# Altium project Beacon.PrjPcb
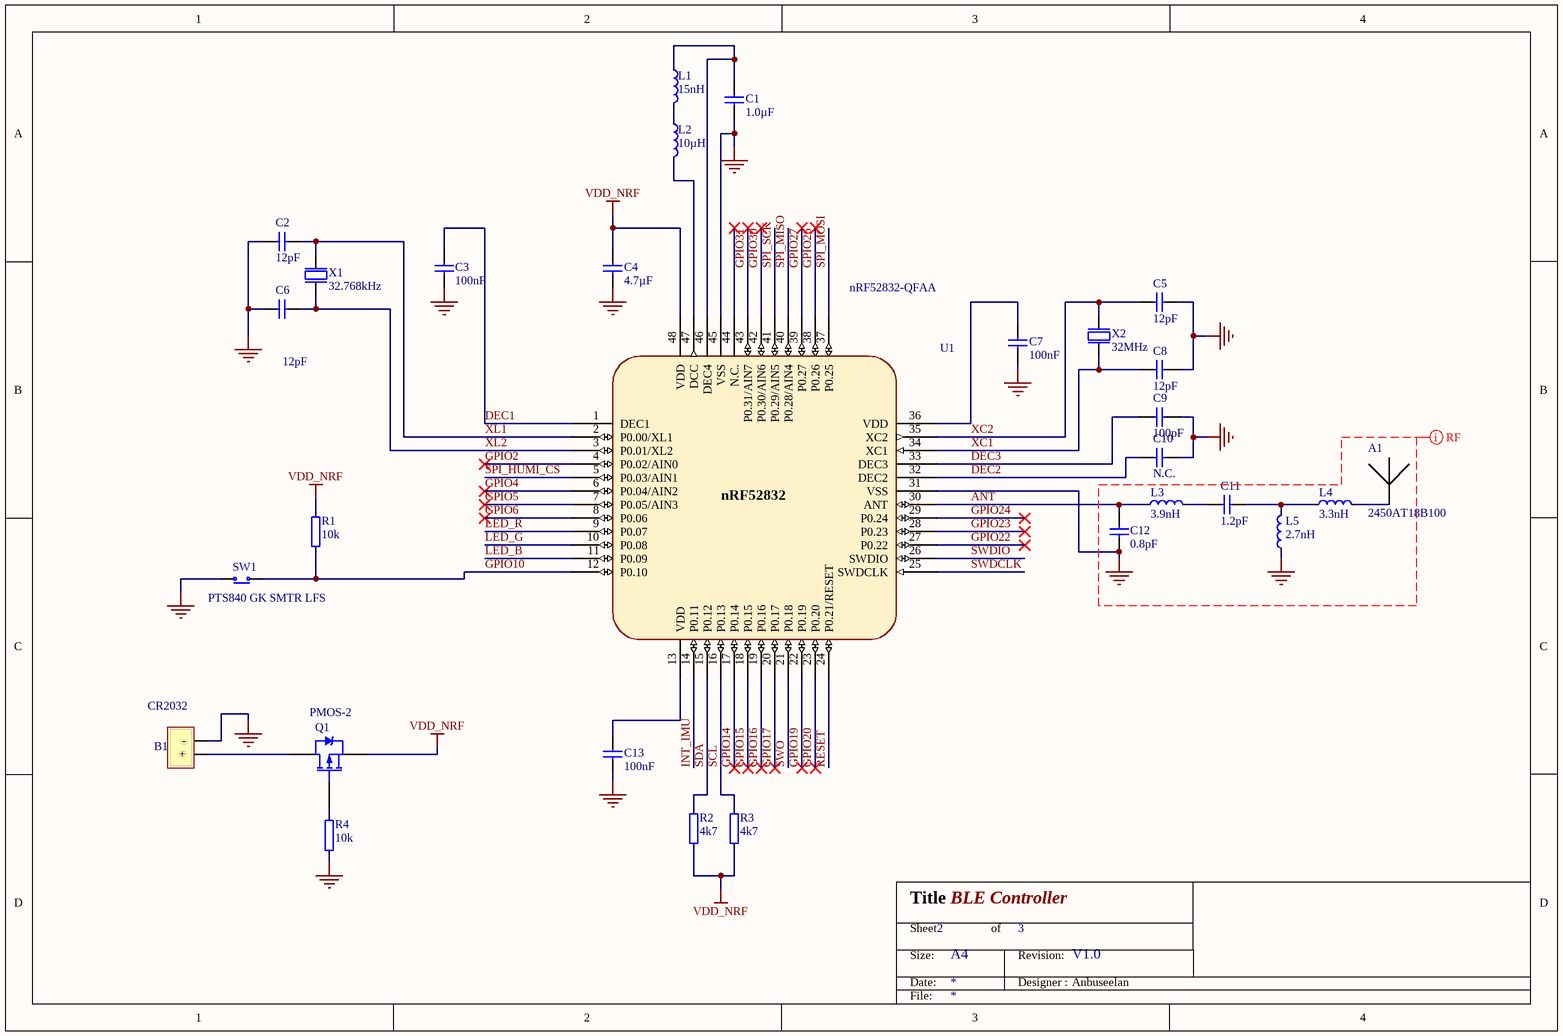
[diagram p0: 02NRF52.SchDoc]
3 sheets, 43 parts. Net scope: global (net labels, ports and power ports of the same name join across sheets).
Board file: Beacon.PcbDoc
Sheets:
  01Main.SchDoc
  02NRF52.SchDoc
  03Sensors.SchDoc

## Sheet 01Main.SchDoc: MainSheet
size A4; Organization: Altium Limited; Revision: V1.0; SheetNumber: 1; SheetTotal: 3

### Notes on the sheet
- Title
- Size:
- Date:
- Sheet
- A4
- of
- Revision:
- Designer :
- Anbuseelan
- File:

## Sheet 02NRF52.SchDoc: BLE Controller
size A4; Organization: Altium Limited; Address1: L3, 12a Rodborough Rd; Address2: Frenchs Forest; Address3: NSW; Address4: Australia 2086; Revision: V1.0; SheetNumber: 2; SheetTotal: 3

### Parts
A1  2450AT18B100  [2450AT18B100]
B1  CR2032  [CR2032-SMD_CR2032(Primary)]
C1  1.0µF  [CAPC1608X06L]
C2  12pF  [CAPC1005X04L]
C3  100nF  [CAPC1005X04L]
C4  4.7µF  [CAPC1608X06L]
C5  12pF  [CAPC1005X04L]
C6  12pF  [CAPC1005X04L]
C7  100nF  [CAPC1005X04L]
C8  12pF  [CAPC1005X04L]
C9  100pF  [CAPC1005X04L]
C10  N.C.  [CAPC1005X04L]
C11  1.2pF  [CAPC1005X04L]
C12  0.8pF  [CAPC1005X04L]
C13  100nF  [CAPC1005X04L]
L1  15nH  [INDC1005X04L]
L2  10µH  [INDC1608X06L]
L3  3.9nH  [INDC1005X04L]
L4  3.3nH  [INDC1005X04L]
L5  2.7nH  [INDC1005X04L]
Q1  PMOS-2  [SOT23_N]
R1  10k  [RESC1005X04L]
R2  4k7  [RESC1005X04L]
R3  4k7  [RESC1005X04L]
R4  10k  [RESC1005X04L]
SW1  PTS840 GK SMTR LFS  [EVQP7A/J/B/K]
U1  nRF52832-QFAA  [QFN40P600X600X90-48N]
X1  32.768kHz  [XTAL_3215]
X2  32MHz  [BT-XTAL_2016]

### Nets
GND: B1.NEG(-) C1.1 C2.2 C3.2 C4.2 C5.2 C6.2 C7.2 C8.2 C9.2 C10.1 C12.1 C13.2 L5.1 R4.1 SW1.1(N.O) U1.31(VSS) U1.45(VSS) U1.49(GND) X2.2(GND) X2.4(GND)
VDD_NRF: C4.1 Q1.3(S) R1.2 R2.1 R3.1 U1.48(VDD)
ANT: C12.2 L3.1 U1.30(ANT)
DEC1: C3.1 U1.1(DEC1)
DEC2: C10.2 U1.32(DEC2)
DEC3: C9.1 U1.33(DEC3)
GPIO2: U1.4(P0.02/AIN0)
GPIO4: U1.6(P0.04/AIN2)
GPIO5: U1.7(P0.05/AIN3)
GPIO6: U1.8(P0.06)
GPIO10: R1.1 SW1.2(COM) U1.12(P0.10)
GPIO14: U1.17(P0.14)
GPIO15: U1.18(P0.15)
GPIO16: U1.19(P0.16)
GPIO17: U1.20(P0.17)
GPIO19: U1.22(P0.19)
GPIO20: U1.23(P0.20)
GPIO22: U1.27(P0.22)
GPIO23: U1.28(P0.23)
GPIO24: U1.29(P0.24)
GPIO26: U1.38(P0.26)
GPIO27: U1.39(P0.27)
GPIO30: U1.42(P0.30/AIN6)
GPIO31: U1.43(P0.31/AIN7)
INT_IMU: U1.14(P0.11)
LED_B: U1.11(P0.09)
LED_G: U1.10(P0.08)
LED_R: U1.9(P0.07)
RESET: U1.24(P0.21/RESET)
SCL: R3.2 U1.16(P0.13)
SDA: R2.2 U1.15(P0.12)
SPI_HUMI_CS: U1.5(P0.03/AIN1)
SPI_MISO: U1.40(P0.28/AIN4)
SPI_MOSI: U1.37(P0.25)
SPI_SCK: U1.41(P0.29/AIN5)
SWDCLK: U1.25(SWDCLK)
SWDIO: U1.26(SWDIO)
SWO: U1.21(P0.18)
XC1: C8.1 U1.34(XC1) X2.1(inp)
XC2: C5.1 U1.35(XC2) X2.3(out)
XL1: C2.1 U1.2(P0.00/XL1) X1.1(inp)
XL2: C6.1 U1.3(P0.01/XL2) X1.2(out)
NetA1_1: A1.1 L4.2
NetB1_POS: B1.POS(+) Q1.2(D)
NetC1_2: C1.2 L1.1 U1.46(DEC4)
NetC7_1: C7.1 U1.36(VDD)
NetC11_1: C11.1 L3.2
NetC11_2: C11.2 L4.1 L5.2
NetC13_1: C13.1 U1.13(VDD)
NetL1_2: L1.2 L2.1
NetL2_2: L2.2 U1.47(DCC)
NetQ1_1: Q1.1(G) R4.2

Not connected (* = marked no-connect by the designer): U1 44(N.C.)*

### Layout directives
net class RF: GND

### Notes on the sheet
- Title
- Size:
- Date:
- Sheet
- A4
- of
- Revision:
- Designer :
- Anbuseelan
- File:
- (in symbol nRF52832_QFAA) nRF52832

### Library data of the parts
A1 = Antenna: 2.45 GHz chip antenna; Part Number: Johanson 2450AT18B100; Manufacturer: Johanson Technology; Artikkelnr Noca: N.A.; Manufacturer Part Number: 2450AT18B100; Datasheet: http://www.johansontechnology.com/datasheets/antennas/2450AT18B100.pdf; Footprint Doc: 2450AT18B100; LatestRevisionDate: 2013-09-13; Pin Count: 2; Publisher: Nordic Semiconductor; Published: 2013-09-13; Value: 2450AT18B100; Note: *; Supplier: Digi-Key; Supplier part number: 712-1006-1-ND; 2nd source Supplier: *; 2nd source part number: *; Artikkelnr Simpro: N.A.
B1 = CR2032: Energizer CR2032 Lithium Button Cell Battery; MF: Panasonic -; MP: CR2032; Availability: Unavailable; SnapEDA_Link: https://www.snapeda.com/parts/CR2032/Panasonic%20-%20BSG/view-part/?ref=snap; Package: FDK; Price: 2.67 USD; Value: *
C1 = CAP: Capacitor, X7R, ±10%; Part Number: C0603-1µ0; Note: 16V; Artikkelnr Noca: 20039335; Artikkelnr Simpro: N.A.; Manufacturer: *; Manufacturer Part Number: *; Datasheet: *; LatestRevisionDate: 2013-06-05; Pin Count: 2; Publisher: Nordic Semiconductor; Published: 2009-05-08; Value: 1.0µF; Supplier: *; Supplier part number: *; 2nd source Supplier: *; 2nd source part number: *; Footprint Doc: 0603
C2 C5 C6 C8 = CAP: Capacitor, NP0, ±2%; Part Number: C0402-12p; Note: 50V; Artikkelnr Noca: 20029159; Artikkelnr Simpro: N.A.; Manufacturer: *; Manufacturer Part Number: *; Datasheet: *; LatestRevisionDate: 2011-05-11; Pin Count: 2; Publisher: Nordic Semiconductor; Published: 2009-05-08; Value: 12pF; Supplier: *; Supplier part number: *; 2nd source Supplier: *; 2nd source part number: *; Footprint Doc: 0402
C3 C7 C13 = CAP: Capacitor, X7R, ±10%; Part Number: C0402-100n; Note: 16V; Artikkelnr Noca: 20039200; Artikkelnr Simpro: N.A.; Manufacturer: *; Manufacturer Part Number: *; Datasheet: *; LatestRevisionDate: 2009-11-23; Pin Count: 2; Publisher: Nordic Semiconductor; Published: 2009-05-08; Value: 100nF; Supplier: *; Supplier part number: *; 2nd source Supplier: *; 2nd source part number: *; Footprint Doc: 0402
C4 = CAP: Capacitor, X5R, ±10%; Part Number: C0603-4µ7; Note: 6.3V; Artikkelnr Noca: 20069060; Artikkelnr Simpro: N.A.; Manufacturer: *; Manufacturer Part Number: *; Datasheet: *; LatestRevisionDate: 2009-11-23; Pin Count: 2; Publisher: Nordic Semiconductor; Published: 2009-05-08; Value: 4.7µF; Supplier: *; Supplier part number: *; 2nd source Supplier: *; 2nd source part number: *; Footprint Doc: 0603
C9 = CAP: Capacitor, NP0, ±5%; Part Number: C0402-100p; Note: 50V; Artikkelnr Noca: 20029135; Artikkelnr Simpro: N.A.; Manufacturer: *; Manufacturer Part Number: *; Datasheet: *; LatestRevisionDate: 2009-05-08; Pin Count: 2; Publisher: Nordic Semiconductor; Published: 2009-05-08; Value: 100pF; Supplier: *; Supplier part number: *; 2nd source Supplier: *; 2nd source part number: *; Footprint Doc: 0402
C10 = CAP: Not mounted; Part Number: C0402-N.C.; Note: Chip Cap; Artikkelnr Noca: N.A.; Assembly: Not mounted; Manufacturer: *; Manufacturer Part Number: *; Datasheet: *; LatestRevisionDate: 2009-05-08; Pin Count: 2; Publisher: Nordic Semiconductor; Published: 2009-05-08; Value: N.C.; Supplier: *; Supplier part number: *; 2nd source Supplier: *; 2nd source part number: *; Footprint Doc: 0402; Artikkelnr Simpro: N.A.
C11 = CAP: Capacitor, NP0, ±0.1pF; Part Number: C0402-1.2p; Note: 50V; Artikkelnr Noca: 20029157; Artikkelnr Simpro: N.A.; Manufacturer: *; Manufacturer Part Number: *; Datasheet: *; Footprint Doc: 0402; LatestRevisionDate: 2011-05-11; Pin Count: 2; Publisher: Nordic Semiconductor; Published: 2009-05-08; Value: 1.2pF; Supplier: *; Supplier part number: *; 2nd source Supplier: *; 2nd source part number: *
C12 = CAP: Capacitor, NP0, ±5%; Part Number: C0402-0.8p; Note: 50V; Artikkelnr Noca: 20029147; Artikkelnr Simpro: N.A.; Manufacturer: *; Manufacturer Part Number: *; Datasheet: *; LatestRevisionDate: 2012-11-21; Pin Count: 2; Publisher: Nordic Semiconductor; Published: 2009-05-08; Value: 0.8pF; Supplier: *; Supplier part number: *; 2nd source Supplier: *; 2nd source part number: *; Footprint Doc: 0402
L1 = IND: Inductor, 320mA, ±5%; Part Number: L0402-15n; Manufacturer: Taiyo Yuden; Manufacturer Part Number: HK100515NJ-T; 2nd source part number: 658-1328; Note: High frequency chip inductor ±10%; Artikkelnr Noca: 33029323; Artikkelnr Simpro: N.A.; LatestRevisionDate: 2012-09-19; Pin Count: 2; Publisher: Nordic Semiconductor; Published: 2010-07-12; Value: 15nH; Supplier: Digi-Key; Datasheet: http://www.yuden.co.jp/productdata/catalog/en/mlci04_e.pdf; Supplier part number: 587-1521-1-ND; 2nd source Supplier: Farnell; Footprint Doc: 0402
L2 = IND: Inductor, 80mA, ±10%; Part Number: L0603-10µ; Manufacturer: Taiyo Yuden; Manufacturer Part Number: LBMF1608T100K; 2nd source part number: 178-6105; Note: LBMF1608T100K 10µH 80mA 0603; Artikkelnr Noca: 33029314; Artikkelnr Simpro: N.A.; Datasheet: http://www.yuden.co.jp/ut/product/pdf/elb2_e.pdf; LatestRevisionDate: 2012-09-19; Pin Count: 2; Publisher: Nordic Semiconductor; Published: 2010-02-24; Value: 10µH; Supplier: Digi-Key; Supplier part number: 587-1714-1-ND; 2nd source Supplier: Farnell; Footprint Doc: 0603
L3 = IND: Inductor, 170mA, ±0.1nH; Part Number: L0402-3n9; Manufacturer: Murata; Manufacturer Part Number: LQP15MN3N9B02D; Note: High frequency chip inductor ±5%; Artikkelnr Noca: 33029151; Artikkelnr Simpro: N.A.; Datasheet: http://search.murata.co.jp/Ceramy/image/img/PDF/ENG/L0075S0084LQP15M.pdf; LatestRevisionDate: 2012-09-19; Pin Count: 2; Publisher: Nordic Semiconductor; Published: 2009-05-08; Value: 3.9nH; Supplier: Digi-Key; Supplier part number: 490-1131-1-ND; 2nd source Supplier: *; 2nd source part number: *; Footprint Doc: 0402
L4 = IND: Inductor, 190mA, ±0.1nH; Part Number: L0402-3n3; Manufacturer: Murata; Manufacturer Part Number: LQP15MN3N3B02D; Note: High frequency chip inductor ±5%; Artikkelnr Noca: 33029369; Artikkelnr Simpro: N.A.; Datasheet: http://search.murata.co.jp/Ceramy/image/img/PDF/ENG/L0075S0084LQP15M.pdf; Footprint Doc: 0402; LatestRevisionDate: 2012-09-19; Pin Count: 2; Publisher: Nordic Semiconductor; Published: 2009-05-08; Value: 3.3nH; Supplier: Digi-Key; Supplier part number: 490-1130-1-ND; 2nd source Supplier: *; 2nd source part number: *
L5 = IND: Inductor, 220mA, ±0.1nH; Part Number: L0402-2n7; Manufacturer: Murata; Manufacturer Part Number: LQP15MN2N7B02D; Note: High frequency chip inductor ±5%; Artikkelnr Noca: 33029150; Artikkelnr Simpro: N.A.; Datasheet: http://search.murata.co.jp/Ceramy/image/img/PDF/ENG/L0075S0084LQP15M.pdf; Footprint Doc: 0402; LatestRevisionDate: 2012-09-19; Pin Count: 2; Publisher: Nordic Semiconductor; Published: 2009-05-08; Value: 2.7nH; Supplier: Digi-Key; Supplier part number: 490-1129-1-ND; 2nd source Supplier: *; 2nd source part number: *
Q1 = PMOS-2: P-Channel Power MOSFET; Note: Pin 4 not drawn and electrically connected to Pin 2.; Published: 8-Jun-2000; LatestRevisionDate: 17-Jul-2002; LatestRevisionNote: Re-released for DXP Platform.; DatasheetVersion: PD-9.390D; PackageVersion: Feb-1997; PackageReference: TO-220AB; Publisher: Altium Limited; PackageDescription: TO, Thru-Hole, Vertical, Heatsink Mounted; 3 In-Line Leads; Pitch 2.54 mm; ComponentLink1Description: Manufacturer Link; ComponentLink1URL: http://www.irf.com/
R1 R4 = RES_1: Resistor, ±1%, 0.063W; Part Number: R0402-10k; Note: Chip Res 1%; Artikkelnr Noca: 27049097; Artikkelnr Simpro: N.A.; Value Ohm: 10000; Manufacturer: *; Manufacturer Part Number: *; Datasheet: *; Footprint Doc: 0402; LatestRevisionDate: 2009-11-23; Pin Count: 2; Publisher: Nordic Semiconductor; Published: 2009-05-08; Value: 10k; Supplier: Farnell; Supplier part number: 173-8864; 2nd source Supplier: *; 2nd source part number: *
R2 R3 = RES_1: Resistor, ±1%, 0.063W; Part Number: R0402-4k7; Note: Chip Res 1%; Artikkelnr Noca: 27049089; Artikkelnr Simpro: N.A.; Value Ohm: 4700; Manufacturer: *; Manufacturer Part Number: *; Datasheet: *; Footprint Doc: 0402; LatestRevisionDate: 2009-11-23; Pin Count: 2; Publisher: Nordic Semiconductor; Published: 2009-05-08; Value: 4k7; Supplier: Farnell; Supplier part number: 173-8858; 2nd source Supplier: *; 2nd source part number: *
SW1 = SW-PB: Microminiature SMT Switch, Side Actuated; Manufacturer: C & K; 2nd source part number: 611-PTS840GKSMTR; Note: Tactile Switch, SPST, SMD, 220gf; Artikkelnr Noca: 50019089; Artikkelnr Simpro: N.A.; Part Number: PTS840 GK SMTR LFS; Manufacturer Part Number: PTS840 GK SMTR LFS; Datasheet: http://www.ck-components.com/80185/pts840_11june13.pdf/; Footprint Doc: PTS840 Gx; LatestRevisionDate: 2014-09-17; Pin Count: 4; Publisher: Nordic Semiconductor; Published: 2014-08-12; Value: PTS840 GK SMTR LFS; Supplier: Digi-Key; Supplier part number: CKN10508CT-ND; 2nd source Supplier: Mouser
U1 = nRF52832_QFAA: Multi-protocol Bluetooth Low Energy, ANT and 2.4GHz proprietary system-on-chip; Manufacturer: Nordic Semiconductor; Artikkelnr Noca: 15079306; Artikkelnr Simpro: N.A.; Part Number: nRF52832-QFAA; Manufacturer Part Number: nRF52832-QFAA; Datasheet: *; LatestRevisionDate: 2016-06-02; Pin Count: 48; Publisher: Nordic Semiconductor; Published: 2014-11-26; Value: nRF52832-QFAA; Note: *; Supplier: Nordic Semiconductor; Supplier part number: *; 2nd source Supplier: *; 2nd source part number: *; Footprint Doc: QFN-48
X1 = XTAL_2-pin: XTAL SMD 2012, 32.768kHz, 9pF, ±20ppm; Part Number: XTAL_SMD3215_32.768kHz_9pF_Seiko; Manufacturer: Seiko; Manufacturer Part Number: SC32S-9.0PF20PPM; Note: XTAL SMD 32.768kHz, 3215; Artikkelnr Noca: N.A.; Datasheet: http://www.sii.co.jp/en/quartz/files/2013/03/file_PRODUCT_MASTER_50812_GRAPHIC03.pdf; LatestRevisionDate: 2015-10-15; Pin Count: 2; Publisher: Nordic Semiconductor; Published: 2015-10-15; Value: 32.768kHz; Supplier: *; Supplier part number: *; 2nd source Supplier: *; 2nd source part number: *; Footprint Doc: XTAL_3215; Artikkelnr Simpro: N.A.
X2 = XTAL_4-pin_grounded: XTAL SMD 2016, 32MHz, Cl=8pF, Tot: ±40ppm; Part Number: XTAL_SMD2016_32MHz_8pF_Kyocera; Manufacturer: Kyocera; Manufacturer Part Number: CX2016DB32000D0WZRC1; Note: XTAL SMD 32.000MHz; Artikkelnr Noca: 22010022; Artikkelnr Simpro: N.A.; Datasheet: http://media.digikey.com/pdf/Data%20Sheets/AVX%20PDFs/CX2016DB32000D0WZRC1_Spec.pdf; LatestRevisionDate: 2016-06-02; Pin Count: 4; Publisher: Nordic Semiconductor; Published: 2015-10-15; Value: 32MHz; Supplier: Digi-Key; Supplier part number: 1253-1586-1-ND; 2nd source Supplier: *; 2nd source part number: *; Footprint Doc: XTAL_2016

## Sheet 03Sensors.SchDoc: Sensors
size A4; Organization: Altium Limited; Revision: V1.0; SheetNumber: 3; SheetTotal: 3
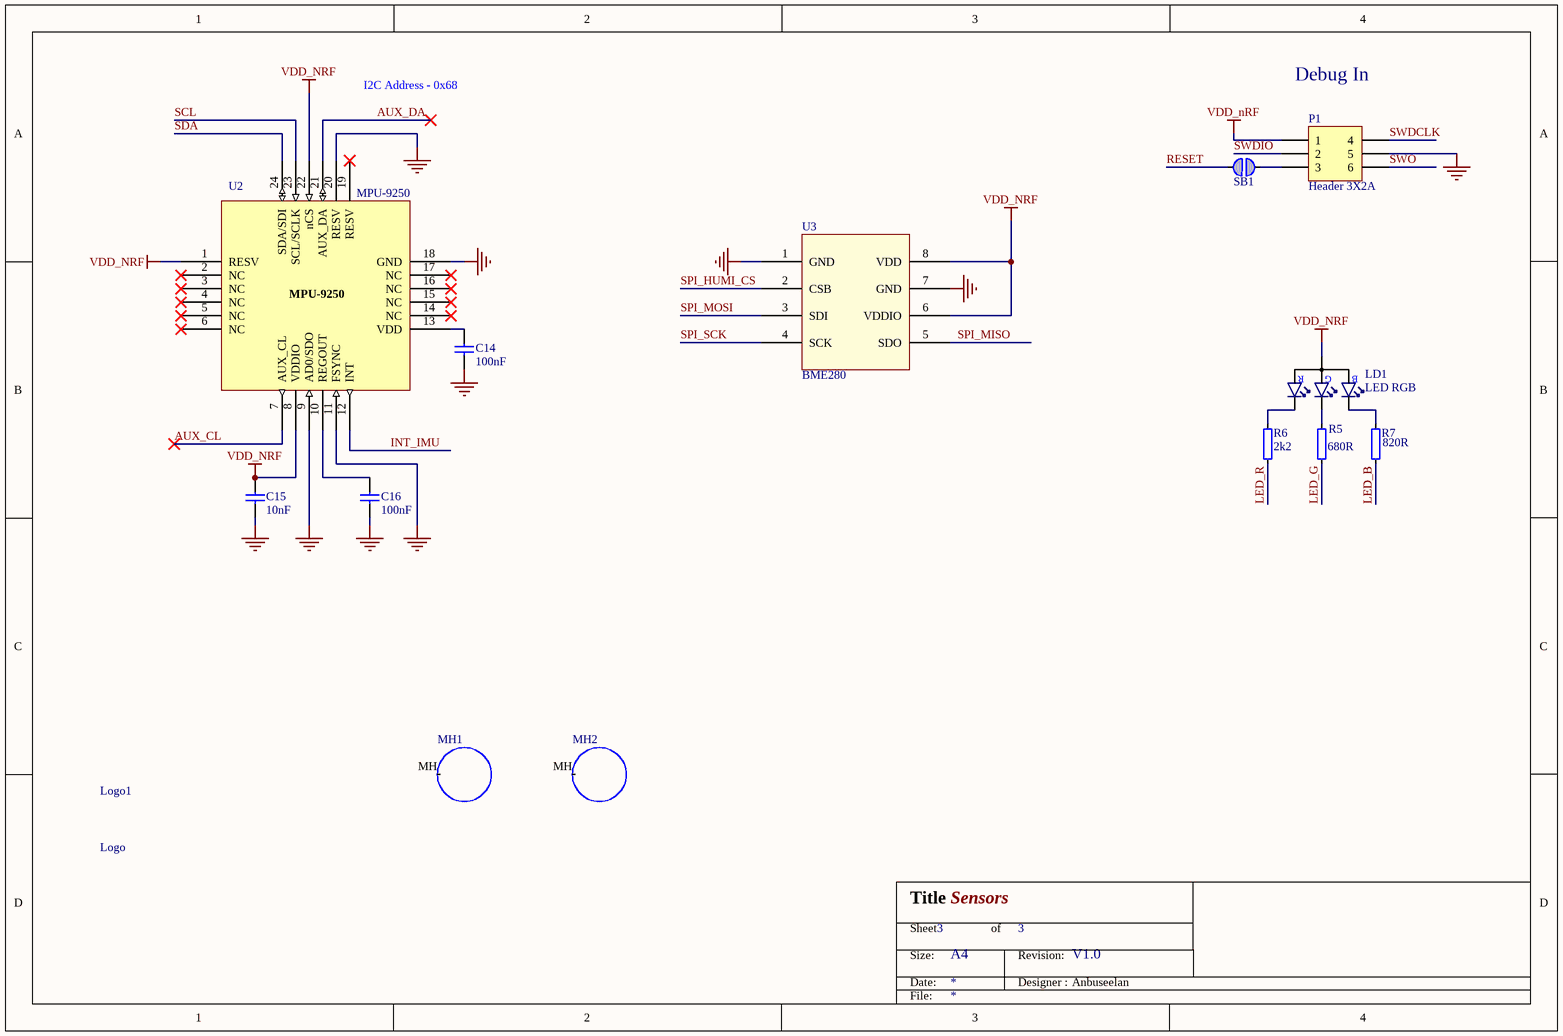
[diagram p1: 03Sensors.SchDoc]

### Parts
C14  100nF  [CAPC1005X04L]
C15  10nF  [CAPC1005X04L]
C16  100nF  [CAPC1005X04L]
LD1  LED RGB  [SML-LX0404SIUPGUSB]
Logo1  Logo  [Logo]
MH1  MH  [MH]  (value not drawn)
MH2  MH  [MH]  (value not drawn)
P1  Header 3X2A  [HDR2X3_CEN]
R5  680R  [RESC1005X04L]
R6  2k2  [RESC1005X04L]
R7  820R  [RESC1005X04L]
SB1  Solderbridge  [Solderbridge]  (value not drawn)  (no BOM)
U2  MPU-9250  [QFN40P300X300X105_HS-25N]
U3  BME280  [PSON65P250X100-8N]

### Nets
GND: C14.1 C15.1 C16.1 P1.5 U2.9(AD0/SDO) U2.11(FSYNC) U2.18(GND) U2.20(RESV) U3.1(GND) U3.7(GND)
VDD_NRF: C15.2 LD1.4(A) P1.1 U2.1(RESV) U2.8(VDDIO) U2.22(nCS) U3.6(VDDIO) U3.8(VDD)
AUX_CL: U2.7(AUX_CL)
AUX_DA: U2.21(AUX_DA)
INT_IMU: U2.12(INT)
LED_B: R7.1
LED_G: R5.1
LED_R: R6.1
RESET: SB1.2
SCL: U2.23(SCL/SCLK)
SDA: U2.24(SDA/SDI)
SPI_HUMI_CS: U3.2(CSB)
SPI_MISO: U3.5(SDO)
SPI_MOSI: U3.3(SDI)
SPI_SCK: U3.4(SCK)
SWDCLK: P1.4
SWDIO: P1.2
SWO: P1.6
NetC14_2: C14.2 U2.13(VDD)
NetC16_2: C16.2 U2.10(REGOUT)
NetLD1_1: LD1.1(C_RED) R6.2
NetLD1_2: LD1.2(C_GREEN) R5.2
NetLD1_3: LD1.3(C_BLUE) R7.2
NetP1_3: P1.3 SB1.1

Not connected (* = marked no-connect by the designer): MH1 MH; MH2 MH; U2 2(NC)* 3(NC)* 4(NC)* 5(NC)* 6(NC)* 14(NC)* 15(NC)* 16(NC)* 17(NC)* 19(RESV)*

### Notes on the sheet
- I2C Address - 0x68
- Debug In
- Title
- Size:
- Date:
- Sheet
- A4
- of
- Revision:
- Designer :
- Anbuseelan
- File:
- (in symbol D:LED_RGB) R; G; B

### Library data of the parts
C14 C16 = CAP: as C3 on sheet 02NRF52; Manufacturer: *; Manufacturer Part Number: *; Datasheet: *; Footprint Doc: 0402; LatestRevisionDate: 2009-11-23; Pin Count: 2; Publisher: Nordic Semiconductor; Published: 2009-05-08; Value: 100nF; Supplier: *; Supplier part number: *; 2nd source Supplier: *; 2nd source part number: *
C15 = CAP: Capacitor, X7R, ±10%; Part Number: C0402-10n; Note: 16V; Artikkelnr Noca: 20039166; Artikkelnr Simpro: N.A.; Manufacturer: *; Manufacturer Part Number: *; Datasheet: *; Footprint Doc: 0402; LatestRevisionDate: 2009-11-23; Pin Count: 2; Publisher: Nordic Semiconductor; Published: 2009-05-08; Value: 10nF; Supplier: *; Supplier part number: *; 2nd source Supplier: *; 2nd source part number: *
LD1 = D:LED_RGB: RGB LED 1.00 mm x 1.00 mm SMD; Manufacturer: Lumex; 2nd source part number: 211-8843; Artikkelnr Noca: 13019150; Artikkelnr Simpro: N.A.; Part Number: SML-LX0404SIUPGUSB; Manufacturer Part Number: SML-LX0404SIUPGUSB; Datasheet: http://media.digikey.com/pdf/Data%20Sheets/Lumex%20PDFs/SML-LX0404SIUPGUSB.pdf; Footprint Doc: SML-LX0404SIUPGUSB; LatestRevisionDate: 2012-10-08; Pin Count: 4; Publisher: Nordic Semiconductor; Published: 2012-10-08; Value: LED RGB; Note: *; Supplier: Digi-Key; Supplier part number: 67-2125-1-ND; 2nd source Supplier: Farnell
P1 = Header 3X2A: Header, 3-Pin, Dual row; LatestRevisionDate: 17-Jul-2002; LatestRevisionNote: Re-released for DXP Platform.; Publisher: Altium Limited
R5 = RES_1: Resistor, ±1%, 0.063W; Part Number: R0402-680; Note: Chip Res 1%; Artikkelnr Noca: 27049069; Artikkelnr Simpro: N.A.; Value Ohm: 680; Manufacturer: *; Manufacturer Part Number: *; Datasheet: *; Footprint Doc: 0402; LatestRevisionDate: 2009-11-23; Pin Count: 2; Publisher: Nordic Semiconductor; Published: 2009-05-08; Value: 680R; Supplier: Farnell; Supplier part number: 173-8848; 2nd source Supplier: *; 2nd source part number: *
R6 = RES_1: Resistor, ±1%, 0.063W; Part Number: R0402-2k2; Note: Chip Res 1%; Artikkelnr Noca: 27049081; Artikkelnr Simpro: N.A.; Value Ohm: 2200; Manufacturer: *; Manufacturer Part Number: *; Datasheet: *; Footprint Doc: 0402; LatestRevisionDate: 2009-11-23; Pin Count: 2; Publisher: Nordic Semiconductor; Published: 2009-05-08; Value: 2k2; Supplier: Farnell; Supplier part number: 173-8854; 2nd source Supplier: *; 2nd source part number: *
R7 = RES_1: Resistor, ±1%, 0.063W; Part Number: R0402-820; Note: Chip Res 1%; Artikkelnr Noca: 27049071; Artikkelnr Simpro: N.A.; Value Ohm: 820; Manufacturer: *; Manufacturer Part Number: *; Datasheet: *; Footprint Doc: 0402; LatestRevisionDate: 2009-11-23; Pin Count: 2; Publisher: Nordic Semiconductor; Published: 2009-05-08; Value: 820R; Supplier: Farnell; Supplier part number: 173-8849; 2nd source Supplier: *; 2nd source part number: *
SB1 = SOLDERBRIDGE: Artikkelnr Noca: N.A.; Part Number: Solderbridge; Manufacturer: *; Manufacturer Part Number: *; Datasheet: *; Footprint Doc: Solderbridge; LatestRevisionDate: 2009-12-14; Pin Count: 2; Publisher: Nordic Semiconductor; Published: 2009-12-14; Value: Solderbridge; Note: *; Supplier: *; Supplier part number: *; 2nd source Supplier: *; 2nd source part number: *; Artikkelnr Simpro: N.A.
U2 = MPU-9250: 9-axis MotionTracking™ Device; Manufacturer: InvenSense; Note: 3-Axis Gyro, 3-Axis Accel and 3-Axis Compass; Artikkelnr Noca: N.A.; Part Number: MPU-9250; Manufacturer Part Number: MPU-9250; Datasheet: http://43zrtwysvxb2gf29r5o0athu.wpengine.netdna-cdn.com/wp-content/uploads/2015/02/MPU-9250-Datasheet.pdf; Footprint Doc: QFN-24; LatestRevisionDate: 2015-06-24; Pin Count: 24; Publisher: Nordic Semiconductor; Published: 2015-06-24; Value: MPU-9250; Supplier: Digi-Key; Supplier part number: 1428-1019-1-ND; 2nd source Supplier: *; 2nd source part number: *; Artikkelnr Simpro: N.A.

## Nets that join several sheets
GND: 02NRF52 (21 pins), 03Sensors (10 pins)
VDD_NRF: 02NRF52 (6 pins), 03Sensors (8 pins)
INT_IMU: 02NRF52 (U1.14), 03Sensors (U2.12)
LED_B: 02NRF52 (U1.11), 03Sensors (R7.1)
LED_G: 02NRF52 (U1.10), 03Sensors (R5.1)
LED_R: 02NRF52 (U1.9), 03Sensors (R6.1)
RESET: 02NRF52 (U1.24), 03Sensors (SB1.2)
SCL: 02NRF52 (R3.2 U1.16), 03Sensors (U2.23)
SDA: 02NRF52 (R2.2 U1.15), 03Sensors (U2.24)
SPI_HUMI_CS: 02NRF52 (U1.5), 03Sensors (U3.2)
SPI_MISO: 02NRF52 (U1.40), 03Sensors (U3.5)
SPI_MOSI: 02NRF52 (U1.37), 03Sensors (U3.3)
SPI_SCK: 02NRF52 (U1.41), 03Sensors (U3.4)
SWDCLK: 02NRF52 (U1.25), 03Sensors (P1.4)
SWDIO: 02NRF52 (U1.26), 03Sensors (P1.2)
SWO: 02NRF52 (U1.21), 03Sensors (P1.6)